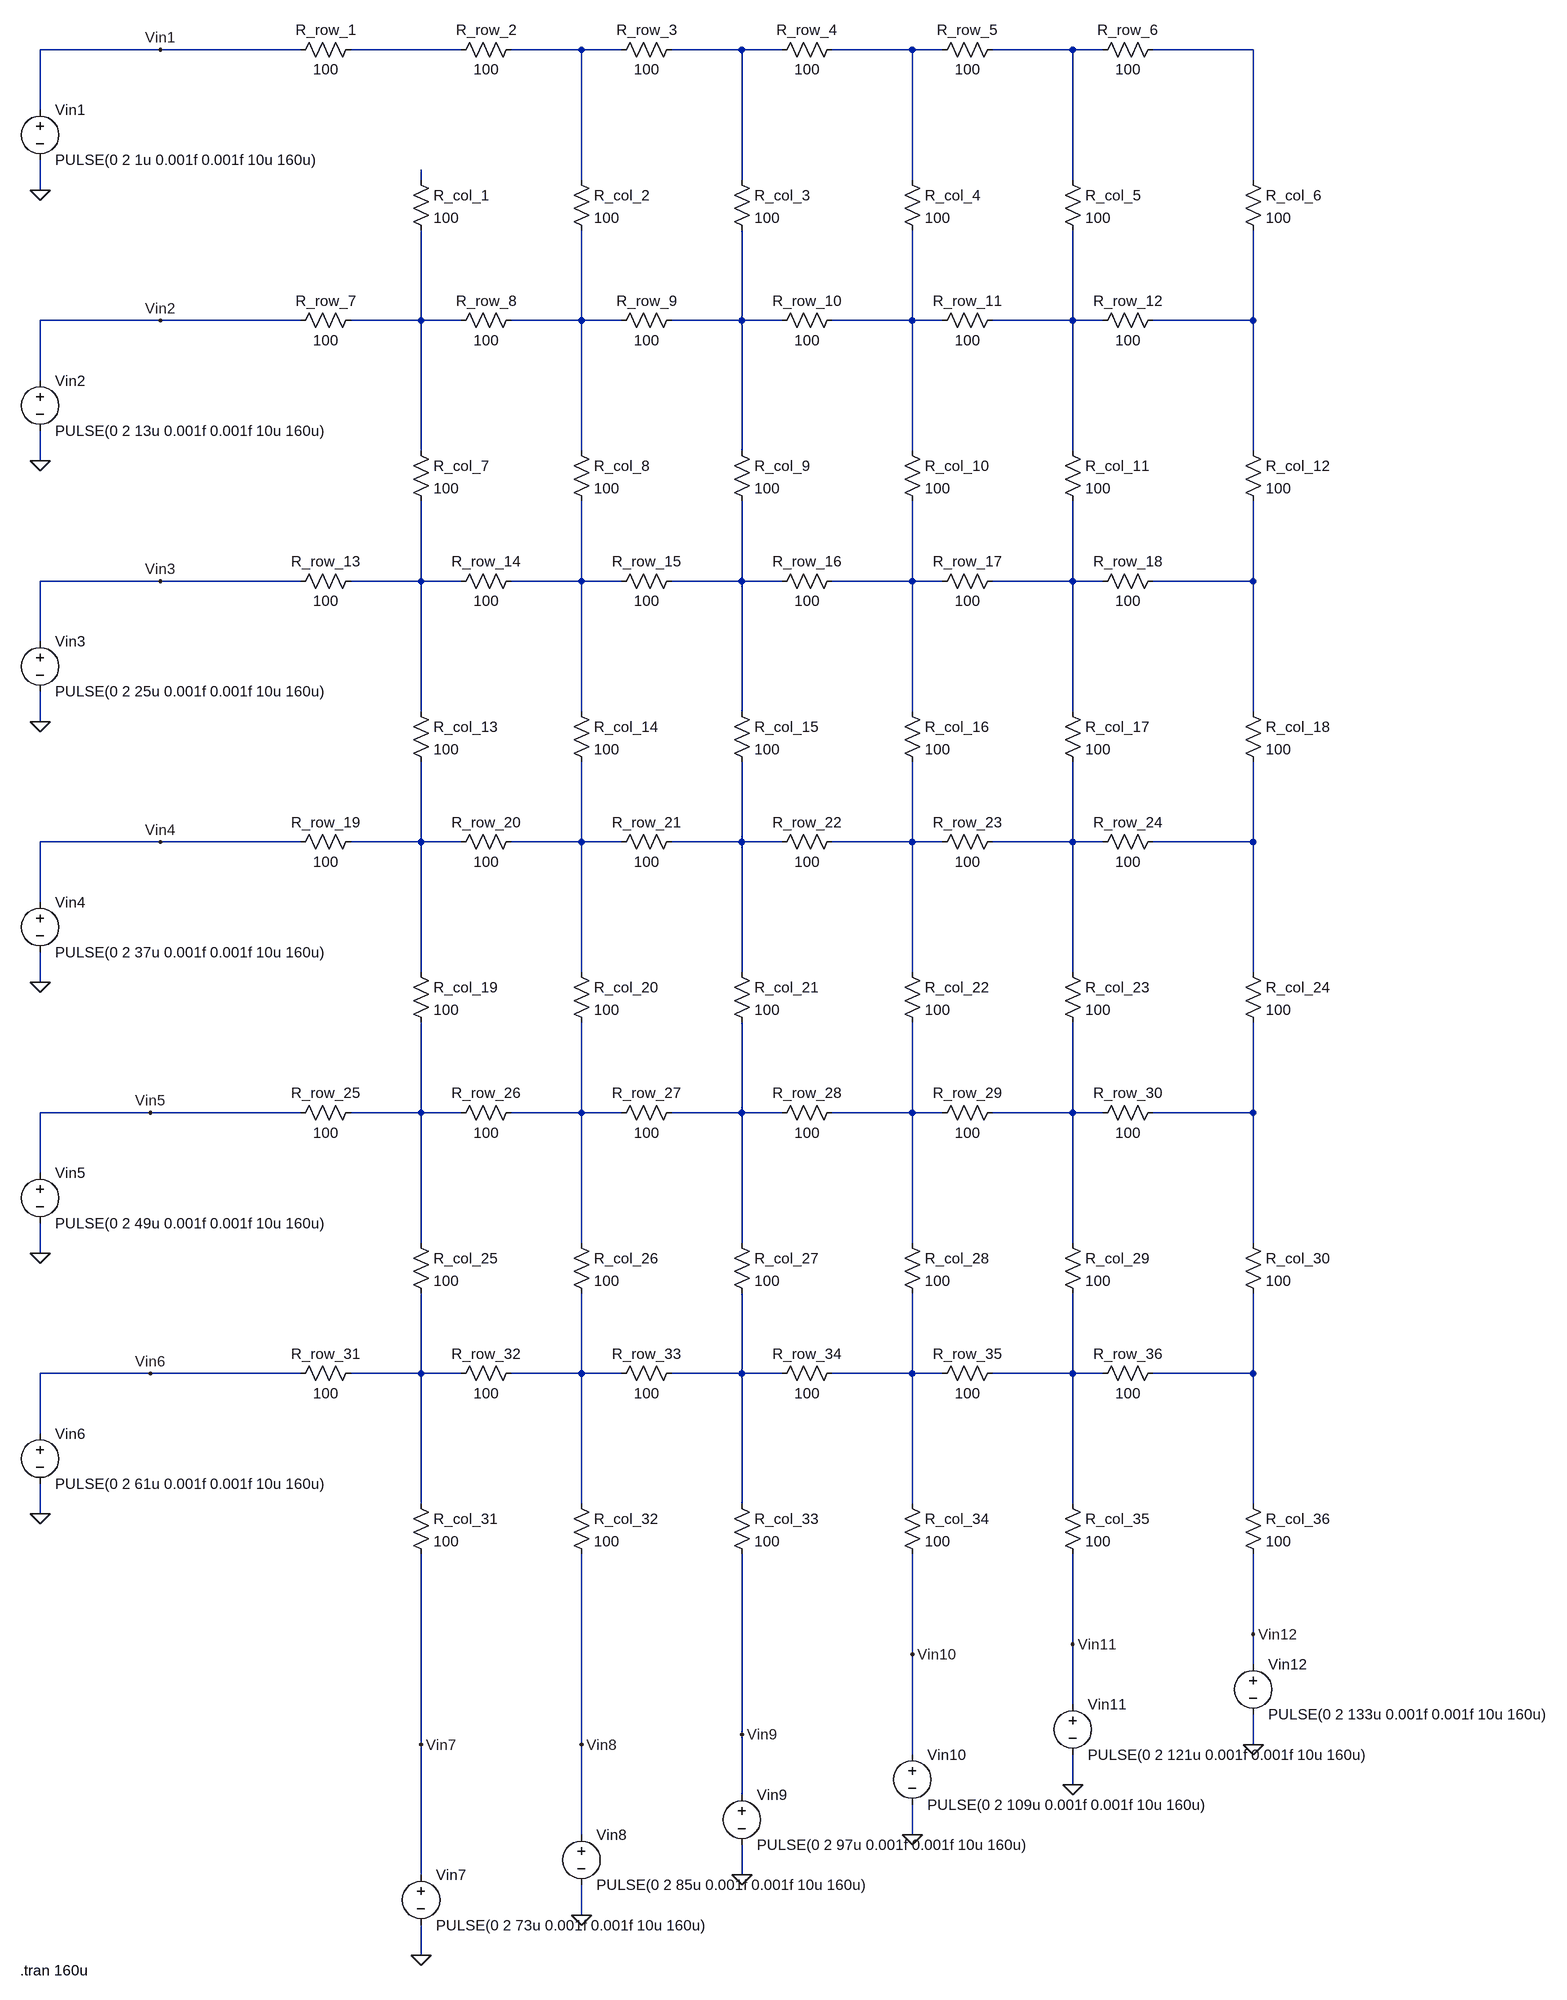
[diagram p0: schematic Memristor_new_1_1_open_6_by_6.asc]
Memristor_new_1_1_open_6_by_6.asc, the LTspice schematic file:
Version 4
SHEET 1 2248 3096
WIRE 0 16 -192 16
WIRE 224 16 0 16
WIRE 480 16 304 16
WIRE 672 16 560 16
WIRE 736 16 672 16
WIRE 928 16 816 16
WIRE 992 16 928 16
WIRE 1200 16 1072 16
WIRE 1248 16 1200 16
WIRE 1456 16 1328 16
WIRE 1504 16 1456 16
WIRE 1744 16 1584 16
WIRE -192 112 -192 16
WIRE 416 224 416 208
WIRE 672 224 672 16
WIRE 928 224 928 16
WIRE 1200 224 1200 16
WIRE 1456 224 1456 16
WIRE 1744 224 1744 16
WIRE -192 240 -192 192
WIRE 0 448 -192 448
WIRE 224 448 0 448
WIRE 416 448 416 304
WIRE 416 448 304 448
WIRE 480 448 416 448
WIRE 672 448 672 304
WIRE 672 448 560 448
WIRE 736 448 672 448
WIRE 928 448 928 304
WIRE 928 448 816 448
WIRE 992 448 928 448
WIRE 1200 448 1200 304
WIRE 1200 448 1072 448
WIRE 1248 448 1200 448
WIRE 1456 448 1456 304
WIRE 1456 448 1328 448
WIRE 1504 448 1456 448
WIRE 1744 448 1744 304
WIRE 1744 448 1584 448
WIRE -192 544 -192 448
WIRE 416 656 416 448
WIRE 672 656 672 448
WIRE 928 656 928 448
WIRE 1200 656 1200 448
WIRE 1456 656 1456 448
WIRE 1744 656 1744 448
WIRE -192 672 -192 624
WIRE 0 864 -192 864
WIRE 224 864 0 864
WIRE 416 864 416 736
WIRE 416 864 304 864
WIRE 480 864 416 864
WIRE 672 864 672 736
WIRE 672 864 560 864
WIRE 736 864 672 864
WIRE 928 864 928 736
WIRE 928 864 816 864
WIRE 992 864 928 864
WIRE 1200 864 1200 736
WIRE 1200 864 1072 864
WIRE 1248 864 1200 864
WIRE 1456 864 1456 736
WIRE 1456 864 1328 864
WIRE 1504 864 1456 864
WIRE 1744 864 1744 736
WIRE 1744 864 1584 864
WIRE -192 960 -192 864
WIRE 416 1072 416 864
WIRE 672 1072 672 864
WIRE 928 1072 928 864
WIRE 1200 1072 1200 864
WIRE 1456 1072 1456 864
WIRE 1744 1072 1744 864
WIRE -192 1088 -192 1040
WIRE 0 1280 -192 1280
WIRE 224 1280 0 1280
WIRE 416 1280 416 1152
WIRE 416 1280 304 1280
WIRE 480 1280 416 1280
WIRE 672 1280 672 1152
WIRE 672 1280 560 1280
WIRE 736 1280 672 1280
WIRE 928 1280 928 1152
WIRE 928 1280 816 1280
WIRE 992 1280 928 1280
WIRE 1200 1280 1200 1152
WIRE 1200 1280 1072 1280
WIRE 1248 1280 1200 1280
WIRE 1456 1280 1456 1152
WIRE 1456 1280 1328 1280
WIRE 1504 1280 1456 1280
WIRE 1744 1280 1744 1152
WIRE 1744 1280 1584 1280
WIRE -192 1376 -192 1280
WIRE 416 1488 416 1280
WIRE 672 1488 672 1280
WIRE 928 1488 928 1280
WIRE 1200 1488 1200 1280
WIRE 1456 1488 1456 1280
WIRE 1744 1488 1744 1280
WIRE -192 1504 -192 1456
WIRE -16 1712 -192 1712
WIRE 224 1712 -16 1712
WIRE 416 1712 416 1568
WIRE 416 1712 304 1712
WIRE 480 1712 416 1712
WIRE 672 1712 672 1568
WIRE 672 1712 560 1712
WIRE 736 1712 672 1712
WIRE 928 1712 928 1568
WIRE 928 1712 816 1712
WIRE 992 1712 928 1712
WIRE 1200 1712 1200 1568
WIRE 1200 1712 1072 1712
WIRE 1248 1712 1200 1712
WIRE 1456 1712 1456 1568
WIRE 1456 1712 1328 1712
WIRE 1504 1712 1456 1712
WIRE 1744 1712 1744 1568
WIRE 1744 1712 1584 1712
WIRE -192 1808 -192 1712
WIRE 416 1920 416 1712
WIRE 672 1920 672 1712
WIRE 928 1920 928 1712
WIRE 1200 1920 1200 1712
WIRE 1456 1920 1456 1712
WIRE 1744 1920 1744 1712
WIRE -192 1936 -192 1888
WIRE -16 2128 -192 2128
WIRE 224 2128 -16 2128
WIRE 416 2128 416 2000
WIRE 416 2128 304 2128
WIRE 480 2128 416 2128
WIRE 672 2128 672 2000
WIRE 672 2128 560 2128
WIRE 736 2128 672 2128
WIRE 928 2128 928 2000
WIRE 928 2128 816 2128
WIRE 992 2128 928 2128
WIRE 1200 2128 1200 2000
WIRE 1200 2128 1072 2128
WIRE 1248 2128 1200 2128
WIRE 1456 2128 1456 2000
WIRE 1456 2128 1328 2128
WIRE 1504 2128 1456 2128
WIRE 1744 2128 1744 2000
WIRE 1744 2128 1584 2128
WIRE -192 2224 -192 2128
WIRE 416 2336 416 2128
WIRE 672 2336 672 2128
WIRE 928 2336 928 2128
WIRE 1200 2336 1200 2128
WIRE 1456 2336 1456 2128
WIRE 1744 2336 1744 2128
WIRE -192 2352 -192 2304
WIRE 1744 2544 1744 2416
WIRE 1456 2560 1456 2416
WIRE 1200 2576 1200 2416
WIRE 1744 2592 1744 2544
WIRE 1456 2656 1456 2560
WIRE 928 2704 928 2416
WIRE 416 2720 416 2416
WIRE 672 2720 672 2416
WIRE 1744 2720 1744 2672
WIRE 1200 2736 1200 2576
WIRE 1456 2784 1456 2736
WIRE 928 2800 928 2704
WIRE 672 2864 672 2720
WIRE 1200 2864 1200 2816
WIRE 416 2928 416 2720
WIRE 928 2928 928 2880
WIRE 672 2992 672 2944
WIRE 416 3056 416 3008
FLAG -192 240 0
FLAG -192 672 0
FLAG -192 1088 0
FLAG -192 1504 0
FLAG -192 1936 0
FLAG -192 2352 0
FLAG 416 3056 0
FLAG 672 2992 0
FLAG 928 2928 0
FLAG 1200 2864 0
FLAG 1456 2784 0
FLAG 1744 2720 0
FLAG 0 16 Vin1
FLAG 0 448 Vin2
FLAG 0 864 Vin3
FLAG 0 1280 Vin4
FLAG -16 1712 Vin5
FLAG -16 2128 Vin6
FLAG 416 2720 Vin7
FLAG 672 2720 Vin8
FLAG 928 2704 Vin9
FLAG 1200 2576 Vin10
FLAG 1456 2560 Vin11
FLAG 1744 2544 Vin12
SYMBOL voltage -192 96 R0
WINDOW 123 0 0 Left 0
WINDOW 39 0 0 Left 0
SYMATTR InstName Vin1
SYMATTR Value PULSE(0 2 1u 0.001f 0.001f 10u 160u)
SYMBOL res 320 0 R90
WINDOW 0 0 56 VBottom 2
WINDOW 3 32 56 VTop 2
SYMATTR InstName R_row_1
SYMATTR Value 100
SYMBOL res 576 0 R90
WINDOW 0 0 56 VBottom 2
WINDOW 3 32 56 VTop 2
SYMATTR InstName R_row_2
SYMATTR Value 100
SYMBOL res 832 0 R90
WINDOW 0 0 56 VBottom 2
WINDOW 3 32 56 VTop 2
SYMATTR InstName R_row_3
SYMATTR Value 100
SYMBOL res 1088 0 R90
WINDOW 0 0 56 VBottom 2
WINDOW 3 32 56 VTop 2
SYMATTR InstName R_row_4
SYMATTR Value 100
SYMBOL res 1344 0 R90
WINDOW 0 0 56 VBottom 2
WINDOW 3 32 56 VTop 2
SYMATTR InstName R_row_5
SYMATTR Value 100
SYMBOL res 1600 0 R90
WINDOW 0 0 56 VBottom 2
WINDOW 3 32 56 VTop 2
SYMATTR InstName R_row_6
SYMATTR Value 100
SYMBOL res 400 208 R0
SYMATTR InstName R_col_1
SYMATTR Value 100
SYMBOL res 656 208 R0
SYMATTR InstName R_col_2
SYMATTR Value 100
SYMBOL res 912 208 R0
SYMATTR InstName R_col_3
SYMATTR Value 100
SYMBOL res 1184 208 R0
SYMATTR InstName R_col_4
SYMATTR Value 100
SYMBOL res 1440 208 R0
SYMATTR InstName R_col_5
SYMATTR Value 100
SYMBOL res 1728 208 R0
SYMATTR InstName R_col_6
SYMATTR Value 100
SYMBOL voltage -192 528 R0
WINDOW 123 0 0 Left 0
WINDOW 39 0 0 Left 0
SYMATTR InstName Vin2
SYMATTR Value PULSE(0 2 13u 0.001f 0.001f 10u 160u)
SYMBOL res 320 432 R90
WINDOW 0 0 56 VBottom 2
WINDOW 3 32 56 VTop 2
SYMATTR InstName R_row_7
SYMATTR Value 100
SYMBOL res 576 432 R90
WINDOW 0 0 56 VBottom 2
WINDOW 3 32 56 VTop 2
SYMATTR InstName R_row_8
SYMATTR Value 100
SYMBOL res 832 432 R90
WINDOW 0 0 56 VBottom 2
WINDOW 3 32 56 VTop 2
SYMATTR InstName R_row_9
SYMATTR Value 100
SYMBOL res 1088 432 R90
WINDOW 0 0 56 VBottom 2
WINDOW 3 32 56 VTop 2
SYMATTR InstName R_row_10
SYMATTR Value 100
SYMBOL res 1344 432 R90
WINDOW 0 0 56 VBottom 2
WINDOW 3 32 56 VTop 2
SYMATTR InstName R_row_11
SYMATTR Value 100
SYMBOL res 1600 432 R90
WINDOW 0 0 56 VBottom 2
WINDOW 3 32 56 VTop 2
SYMATTR InstName R_row_12
SYMATTR Value 100
SYMBOL res 400 640 R0
SYMATTR InstName R_col_7
SYMATTR Value 100
SYMBOL res 656 640 R0
SYMATTR InstName R_col_8
SYMATTR Value 100
SYMBOL res 912 640 R0
SYMATTR InstName R_col_9
SYMATTR Value 100
SYMBOL res 1184 640 R0
SYMATTR InstName R_col_10
SYMATTR Value 100
SYMBOL res 1440 640 R0
SYMATTR InstName R_col_11
SYMATTR Value 100
SYMBOL res 1728 640 R0
SYMATTR InstName R_col_12
SYMATTR Value 100
SYMBOL voltage -192 944 R0
WINDOW 123 0 0 Left 0
WINDOW 39 0 0 Left 0
SYMATTR InstName Vin3
SYMATTR Value PULSE(0 2 25u 0.001f 0.001f 10u 160u)
SYMBOL res 320 848 R90
WINDOW 0 0 56 VBottom 2
WINDOW 3 32 56 VTop 2
SYMATTR InstName R_row_13
SYMATTR Value 100
SYMBOL res 576 848 R90
WINDOW 0 0 56 VBottom 2
WINDOW 3 32 56 VTop 2
SYMATTR InstName R_row_14
SYMATTR Value 100
SYMBOL res 832 848 R90
WINDOW 0 0 56 VBottom 2
WINDOW 3 32 56 VTop 2
SYMATTR InstName R_row_15
SYMATTR Value 100
SYMBOL res 1088 848 R90
WINDOW 0 0 56 VBottom 2
WINDOW 3 32 56 VTop 2
SYMATTR InstName R_row_16
SYMATTR Value 100
SYMBOL res 1344 848 R90
WINDOW 0 0 56 VBottom 2
WINDOW 3 32 56 VTop 2
SYMATTR InstName R_row_17
SYMATTR Value 100
SYMBOL res 1600 848 R90
WINDOW 0 0 56 VBottom 2
WINDOW 3 32 56 VTop 2
SYMATTR InstName R_row_18
SYMATTR Value 100
SYMBOL res 400 1056 R0
SYMATTR InstName R_col_13
SYMATTR Value 100
SYMBOL res 656 1056 R0
SYMATTR InstName R_col_14
SYMATTR Value 100
SYMBOL res 912 1056 R0
SYMATTR InstName R_col_15
SYMATTR Value 100
SYMBOL res 1184 1056 R0
SYMATTR InstName R_col_16
SYMATTR Value 100
SYMBOL res 1440 1056 R0
SYMATTR InstName R_col_17
SYMATTR Value 100
SYMBOL res 1728 1056 R0
SYMATTR InstName R_col_18
SYMATTR Value 100
SYMBOL voltage -192 1360 R0
WINDOW 123 0 0 Left 0
WINDOW 39 0 0 Left 0
SYMATTR InstName Vin4
SYMATTR Value PULSE(0 2 37u 0.001f 0.001f 10u 160u)
SYMBOL res 320 1264 R90
WINDOW 0 0 56 VBottom 2
WINDOW 3 32 56 VTop 2
SYMATTR InstName R_row_19
SYMATTR Value 100
SYMBOL res 576 1264 R90
WINDOW 0 0 56 VBottom 2
WINDOW 3 32 56 VTop 2
SYMATTR InstName R_row_20
SYMATTR Value 100
SYMBOL res 832 1264 R90
WINDOW 0 0 56 VBottom 2
WINDOW 3 32 56 VTop 2
SYMATTR InstName R_row_21
SYMATTR Value 100
SYMBOL res 1088 1264 R90
WINDOW 0 0 56 VBottom 2
WINDOW 3 32 56 VTop 2
SYMATTR InstName R_row_22
SYMATTR Value 100
SYMBOL res 1344 1264 R90
WINDOW 0 0 56 VBottom 2
WINDOW 3 32 56 VTop 2
SYMATTR InstName R_row_23
SYMATTR Value 100
SYMBOL res 1600 1264 R90
WINDOW 0 0 56 VBottom 2
WINDOW 3 32 56 VTop 2
SYMATTR InstName R_row_24
SYMATTR Value 100
SYMBOL res 400 1472 R0
SYMATTR InstName R_col_19
SYMATTR Value 100
SYMBOL res 656 1472 R0
SYMATTR InstName R_col_20
SYMATTR Value 100
SYMBOL res 912 1472 R0
SYMATTR InstName R_col_21
SYMATTR Value 100
SYMBOL res 1184 1472 R0
SYMATTR InstName R_col_22
SYMATTR Value 100
SYMBOL res 1440 1472 R0
SYMATTR InstName R_col_23
SYMATTR Value 100
SYMBOL res 1728 1472 R0
SYMATTR InstName R_col_24
SYMATTR Value 100
SYMBOL voltage -192 1792 R0
WINDOW 123 0 0 Left 0
WINDOW 39 0 0 Left 0
SYMATTR InstName Vin5
SYMATTR Value PULSE(0 2 49u 0.001f 0.001f 10u 160u)
SYMBOL res 320 1696 R90
WINDOW 0 0 56 VBottom 2
WINDOW 3 32 56 VTop 2
SYMATTR InstName R_row_25
SYMATTR Value 100
SYMBOL res 576 1696 R90
WINDOW 0 0 56 VBottom 2
WINDOW 3 32 56 VTop 2
SYMATTR InstName R_row_26
SYMATTR Value 100
SYMBOL res 832 1696 R90
WINDOW 0 0 56 VBottom 2
WINDOW 3 32 56 VTop 2
SYMATTR InstName R_row_27
SYMATTR Value 100
SYMBOL res 1088 1696 R90
WINDOW 0 0 56 VBottom 2
WINDOW 3 32 56 VTop 2
SYMATTR InstName R_row_28
SYMATTR Value 100
SYMBOL res 1344 1696 R90
WINDOW 0 0 56 VBottom 2
WINDOW 3 32 56 VTop 2
SYMATTR InstName R_row_29
SYMATTR Value 100
SYMBOL res 1600 1696 R90
WINDOW 0 0 56 VBottom 2
WINDOW 3 32 56 VTop 2
SYMATTR InstName R_row_30
SYMATTR Value 100
SYMBOL res 400 1904 R0
SYMATTR InstName R_col_25
SYMATTR Value 100
SYMBOL res 656 1904 R0
SYMATTR InstName R_col_26
SYMATTR Value 100
SYMBOL res 912 1904 R0
SYMATTR InstName R_col_27
SYMATTR Value 100
SYMBOL res 1184 1904 R0
SYMATTR InstName R_col_28
SYMATTR Value 100
SYMBOL res 1440 1904 R0
SYMATTR InstName R_col_29
SYMATTR Value 100
SYMBOL res 1728 1904 R0
SYMATTR InstName R_col_30
SYMATTR Value 100
SYMBOL voltage -192 2208 R0
WINDOW 123 0 0 Left 0
WINDOW 39 0 0 Left 0
SYMATTR InstName Vin6
SYMATTR Value PULSE(0 2 61u 0.001f 0.001f 10u 160u)
SYMBOL res 320 2112 R90
WINDOW 0 0 56 VBottom 2
WINDOW 3 32 56 VTop 2
SYMATTR InstName R_row_31
SYMATTR Value 100
SYMBOL res 576 2112 R90
WINDOW 0 0 56 VBottom 2
WINDOW 3 32 56 VTop 2
SYMATTR InstName R_row_32
SYMATTR Value 100
SYMBOL res 832 2112 R90
WINDOW 0 0 56 VBottom 2
WINDOW 3 32 56 VTop 2
SYMATTR InstName R_row_33
SYMATTR Value 100
SYMBOL res 1088 2112 R90
WINDOW 0 0 56 VBottom 2
WINDOW 3 32 56 VTop 2
SYMATTR InstName R_row_34
SYMATTR Value 100
SYMBOL res 1344 2112 R90
WINDOW 0 0 56 VBottom 2
WINDOW 3 32 56 VTop 2
SYMATTR InstName R_row_35
SYMATTR Value 100
SYMBOL res 1600 2112 R90
WINDOW 0 0 56 VBottom 2
WINDOW 3 32 56 VTop 2
SYMATTR InstName R_row_36
SYMATTR Value 100
SYMBOL res 400 2320 R0
SYMATTR InstName R_col_31
SYMATTR Value 100
SYMBOL res 656 2320 R0
SYMATTR InstName R_col_32
SYMATTR Value 100
SYMBOL res 912 2320 R0
SYMATTR InstName R_col_33
SYMATTR Value 100
SYMBOL res 1184 2320 R0
SYMATTR InstName R_col_34
SYMATTR Value 100
SYMBOL res 1440 2320 R0
SYMATTR InstName R_col_35
SYMATTR Value 100
SYMBOL res 1728 2320 R0
SYMATTR InstName R_col_36
SYMATTR Value 100
SYMBOL voltage 416 2912 R0
WINDOW 123 0 0 Left 0
WINDOW 39 0 0 Left 0
SYMATTR InstName Vin7
SYMATTR Value PULSE(0 2 73u 0.001f 0.001f 10u 160u)
SYMBOL voltage 672 2848 R0
WINDOW 123 0 0 Left 0
WINDOW 39 0 0 Left 0
SYMATTR InstName Vin8
SYMATTR Value PULSE(0 2 85u 0.001f 0.001f 10u 160u)
SYMBOL voltage 928 2784 R0
WINDOW 123 0 0 Left 0
WINDOW 39 0 0 Left 0
SYMATTR InstName Vin9
SYMATTR Value PULSE(0 2 97u 0.001f 0.001f 10u 160u)
SYMBOL voltage 1200 2720 R0
WINDOW 123 0 0 Left 0
WINDOW 39 0 0 Left 0
SYMATTR InstName Vin10
SYMATTR Value PULSE(0 2 109u 0.001f 0.001f 10u 160u)
SYMBOL voltage 1456 2640 R0
WINDOW 123 0 0 Left 0
WINDOW 39 0 0 Left 0
SYMATTR InstName Vin11
SYMATTR Value PULSE(0 2 121u 0.001f 0.001f 10u 160u)
SYMBOL voltage 1744 2576 R0
WINDOW 123 0 0 Left 0
WINDOW 39 0 0 Left 0
SYMATTR InstName Vin12
SYMATTR Value PULSE(0 2 133u 0.001f 0.001f 10u 160u)
TEXT -224 3080 Left 2 !.tran 160u

The netlist it stands for:
* Memristor_new_1_1_open_6_by_6.asc
Vin1 Vin1 0 PULSE(0 2 1u 0.001f 0.001f 10u 160u)
R_row_1 N001 Vin1 100
R_row_2 N002 N001 100
R_row_3 N003 N002 100
R_row_4 N004 N003 100
R_row_5 N005 N004 100
R_row_6 N006 N005 100
R_col_1 N007 N008 100
R_col_2 N002 N009 100
R_col_3 N003 N010 100
R_col_4 N004 N011 100
R_col_5 N005 N012 100
R_col_6 N006 N013 100
Vin2 Vin2 0 PULSE(0 2 13u 0.001f 0.001f 10u 160u)
R_row_7 N008 Vin2 100
R_row_8 N009 N008 100
R_row_9 N010 N009 100
R_row_10 N011 N010 100
R_row_11 N012 N011 100
R_row_12 N013 N012 100
R_col_7 N008 N014 100
R_col_8 N009 N015 100
R_col_9 N010 N016 100
R_col_10 N011 N017 100
R_col_11 N012 N018 100
R_col_12 N013 N019 100
Vin3 Vin3 0 PULSE(0 2 25u 0.001f 0.001f 10u 160u)
R_row_13 N014 Vin3 100
R_row_14 N015 N014 100
R_row_15 N016 N015 100
R_row_16 N017 N016 100
R_row_17 N018 N017 100
R_row_18 N019 N018 100
R_col_13 N014 N020 100
R_col_14 N015 N021 100
R_col_15 N016 N022 100
R_col_16 N017 N023 100
R_col_17 N018 N024 100
R_col_18 N019 N025 100
Vin4 Vin4 0 PULSE(0 2 37u 0.001f 0.001f 10u 160u)
R_row_19 N020 Vin4 100
R_row_20 N021 N020 100
R_row_21 N022 N021 100
R_row_22 N023 N022 100
R_row_23 N024 N023 100
R_row_24 N025 N024 100
R_col_19 N020 N026 100
R_col_20 N021 N027 100
R_col_21 N022 N028 100
R_col_22 N023 N029 100
R_col_23 N024 N030 100
R_col_24 N025 N031 100
Vin5 Vin5 0 PULSE(0 2 49u 0.001f 0.001f 10u 160u)
R_row_25 N026 Vin5 100
R_row_26 N027 N026 100
R_row_27 N028 N027 100
R_row_28 N029 N028 100
R_row_29 N030 N029 100
R_row_30 N031 N030 100
R_col_25 N026 N032 100
R_col_26 N027 N033 100
R_col_27 N028 N034 100
R_col_28 N029 N035 100
R_col_29 N030 N036 100
R_col_30 N031 N037 100
Vin6 Vin6 0 PULSE(0 2 61u 0.001f 0.001f 10u 160u)
R_row_31 N032 Vin6 100
R_row_32 N033 N032 100
R_row_33 N034 N033 100
R_row_34 N035 N034 100
R_row_35 N036 N035 100
R_row_36 N037 N036 100
R_col_31 N032 Vin7 100
R_col_32 N033 Vin8 100
R_col_33 N034 Vin9 100
R_col_34 N035 Vin10 100
R_col_35 N036 Vin11 100
R_col_36 N037 Vin12 100
Vin7 Vin7 0 PULSE(0 2 73u 0.001f 0.001f 10u 160u)
Vin8 Vin8 0 PULSE(0 2 85u 0.001f 0.001f 10u 160u)
Vin9 Vin9 0 PULSE(0 2 97u 0.001f 0.001f 10u 160u)
Vin10 Vin10 0 PULSE(0 2 109u 0.001f 0.001f 10u 160u)
Vin11 Vin11 0 PULSE(0 2 121u 0.001f 0.001f 10u 160u)
Vin12 Vin12 0 PULSE(0 2 133u 0.001f 0.001f 10u 160u)
.tran 160u
.backanno
.end